# Altium schematic sheet LED2.SchDoc
size A4
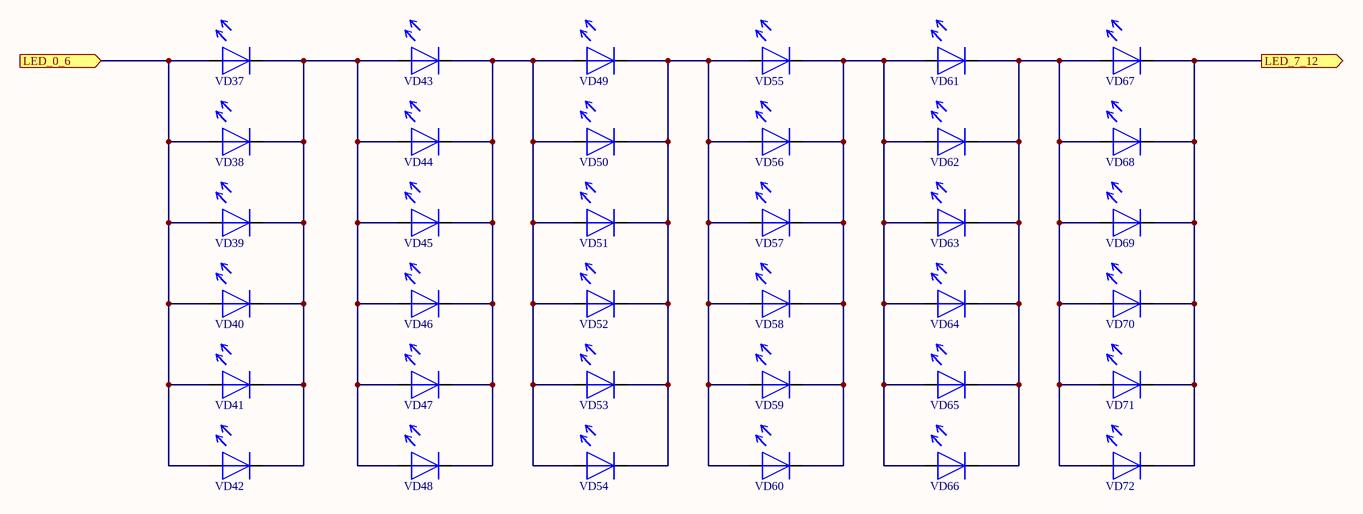
[diagram p0: LED2.SchDoc]

## Parts
VD37  SPMWHT541MD5WAT0SB  [LED_Samsung]  (value not drawn)
VD38  SPMWHT541MD5WAT0SB  [LED_Samsung]  (value not drawn)
VD39  SPMWHT541MD5WAT0SB  [LED_Samsung]  (value not drawn)
VD40  SPMWHT541MD5WAT0SB  [LED_Samsung]  (value not drawn)
VD41  SPMWHT541MD5WAT0SB  [LED_Samsung]  (value not drawn)
VD42  SPMWHT541MD5WAT0SB  [LED_Samsung]  (value not drawn)
VD43  SPMWHT541MD5WAT0SB  [LED_Samsung]  (value not drawn)
VD44  SPMWHT541MD5WAT0SB  [LED_Samsung]  (value not drawn)
VD45  SPMWHT541MD5WAT0SB  [LED_Samsung]  (value not drawn)
VD46  SPMWHT541MD5WAT0SB  [LED_Samsung]  (value not drawn)
VD47  SPMWHT541MD5WAT0SB  [LED_Samsung]  (value not drawn)
VD48  SPMWHT541MD5WAT0SB  [LED_Samsung]  (value not drawn)
VD49  SPMWHT541MD5WAT0SB  [LED_Samsung]  (value not drawn)
VD50  SPMWHT541MD5WAT0SB  [LED_Samsung]  (value not drawn)
VD51  SPMWHT541MD5WAT0SB  [LED_Samsung]  (value not drawn)
VD52  SPMWHT541MD5WAT0SB  [LED_Samsung]  (value not drawn)
VD53  SPMWHT541MD5WAT0SB  [LED_Samsung]  (value not drawn)
VD54  SPMWHT541MD5WAT0SB  [LED_Samsung]  (value not drawn)
VD55  SPMWHT541MD5WAT0SB  [LED_Samsung]  (value not drawn)
VD56  SPMWHT541MD5WAT0SB  [LED_Samsung]  (value not drawn)
VD57  SPMWHT541MD5WAT0SB  [LED_Samsung]  (value not drawn)
VD58  SPMWHT541MD5WAT0SB  [LED_Samsung]  (value not drawn)
VD59  SPMWHT541MD5WAT0SB  [LED_Samsung]  (value not drawn)
VD60  SPMWHT541MD5WAT0SB  [LED_Samsung]  (value not drawn)
VD61  SPMWHT541MD5WAT0SB  [LED_Samsung]  (value not drawn)
VD62  SPMWHT541MD5WAT0SB  [LED_Samsung]  (value not drawn)
VD63  SPMWHT541MD5WAT0SB  [LED_Samsung]  (value not drawn)
VD64  SPMWHT541MD5WAT0SB  [LED_Samsung]  (value not drawn)
VD65  SPMWHT541MD5WAT0SB  [LED_Samsung]  (value not drawn)
VD66  SPMWHT541MD5WAT0SB  [LED_Samsung]  (value not drawn)
VD67  SPMWHT541MD5WAT0SB  [LED_Samsung]  (value not drawn)
VD68  SPMWHT541MD5WAT0SB  [LED_Samsung]  (value not drawn)
VD69  SPMWHT541MD5WAT0SB  [LED_Samsung]  (value not drawn)
VD70  SPMWHT541MD5WAT0SB  [LED_Samsung]  (value not drawn)
VD71  SPMWHT541MD5WAT0SB  [LED_Samsung]  (value not drawn)
VD72  SPMWHT541MD5WAT0SB  [LED_Samsung]  (value not drawn)

## Ports
LED_0_6 (in), LED_7_12 (out)

## Nets
LED_0_6: VD37.1 VD38.1 VD39.1 VD40.1 VD41.1 VD42.1 ; port LED_0_6
LED_7_12: VD67.2 VD68.2 VD69.2 VD70.2 VD71.2 VD72.2 ; port LED_7_12
NetVD37_2: VD37.2 VD38.2 VD39.2 VD40.2 VD41.2 VD42.2 VD43.1 VD44.1 VD45.1 VD46.1 VD47.1 VD48.1
NetVD43_2: VD43.2 VD44.2 VD45.2 VD46.2 VD47.2 VD48.2 VD49.1 VD50.1 VD51.1 VD52.1 VD53.1 VD54.1
NetVD49_2: VD49.2 VD50.2 VD51.2 VD52.2 VD53.2 VD54.2 VD55.1 VD56.1 VD57.1 VD58.1 VD59.1 VD60.1
NetVD55_2: VD55.2 VD56.2 VD57.2 VD58.2 VD59.2 VD60.2 VD61.1 VD62.1 VD63.1 VD64.1 VD65.1 VD66.1
NetVD61_2: VD61.2 VD62.2 VD63.2 VD64.2 VD65.2 VD66.2 VD67.1 VD68.1 VD69.1 VD70.1 VD71.1 VD72.1

## Library data of the parts
VD37-VD72 = LED SPMWHT541MD5WAT0SB: Value: SPMWHT541MD5WAT0SB